# Altium project tunnelAmp.PrjPcb
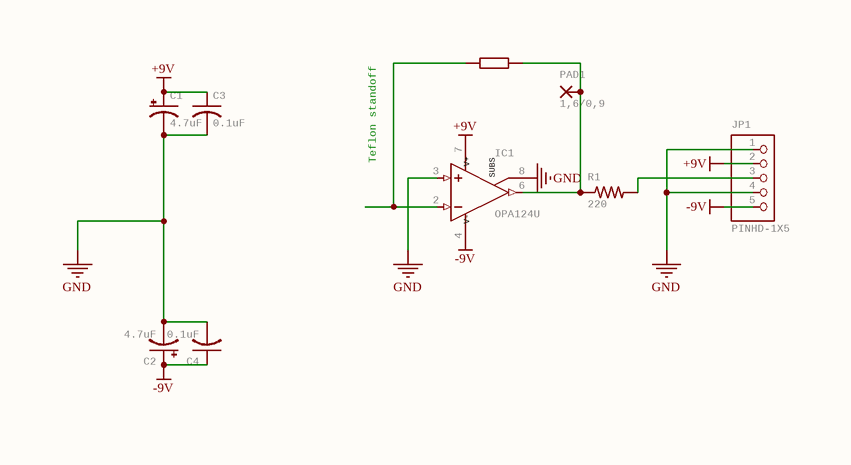
[diagram p0: tunnelAmp.SchDoc]
1 sheet, 9 parts. Net scope: global (net labels, ports and power ports of the same name join across sheets).
Board file: tunnelAmp.PcbDoc

## Sheet tunnelAmp.SchDoc
size 148 x 80 mm; Origin: Eagle

### Parts
C1  4.7uF  [C/6032-28W]
C2  4.7uF  [C/6032-28W]
C3  0.1uF  [C0603]
C4  0.1uF  [C0603]
IC1  OPA124U  [SO08]
JP1  PINHD-1X5  [1X05]
PAD1  1,6/0,9  [1,6/0,9]
R1  220  [R0603]
R3  100M  (value not drawn)

### Nets
+9V: C1.+ C3.1 IC1.7(V+) JP1.2
-9V: C2.+ C4.1 IC1.4(V-) JP1.5
GND: C1.- C2.- C3.2 C4.2 IC1.3(+IN) IC1.8(SUBS) JP1.1 JP1.4
NetIC1_6: IC1.6(OUT) PAD1.1(P) R1.1
NetJP1_3: JP1.3 R1.2

Not connected (* = marked no-connect by the designer): IC1 2(-IN)

### Notes on the sheet
- Teflon standoff

### Library data of the parts
C1 C2 = CPOL-USC/6032-28W: POLARIZED CAPACITOR, American symbol; GateName_1: G$1; SymbolName_1: CPOL-US; DeviceName: C/6032-28W; LibraryName: resistor; DeviceSetName: CPOL-US
C3 C4 = C-USC0603: CAPACITOR, American symbol; GateName_1: G$1; SymbolName_1: C-US; DeviceName: C0603; LibraryName: resistor; DeviceSetName: C-US
IC1 = OPA124U: Difet Operational Amplifier; GateName_1: G$1; SymbolName_1: SUBS; LibraryName: burr-brown; DeviceSetName: OPA124U; V+: V+; V-: V-; SUBS: SUBS
JP1 = PINHD-1X5: PIN HEADER; GateName_1: A; SymbolName_1: PINHD5; LibraryName: pinhead; DeviceSetName: PINHD-1X5
PAD1 = 1,6/0,9: THROUGH-HOLE PAD; GateName_1: 1; SymbolName_1: PAD; LibraryName: wirepad; DeviceSetName: 1,6/0,9
R1 = R-US_R0603: RESISTOR, American symbol; GateName_1: G$1; SymbolName_1: R-US; DeviceSetName: R-US_; DeviceName: R0603; LibraryName: resistor
R3 = R: RESISTOR; GateName_1: G$1; SymbolName_1: RESISTOR; LibraryName: docu-dummy; DeviceSetName: R